# EAGLE design ResponseBoxV1B3 (EAGLE 7.3.0)
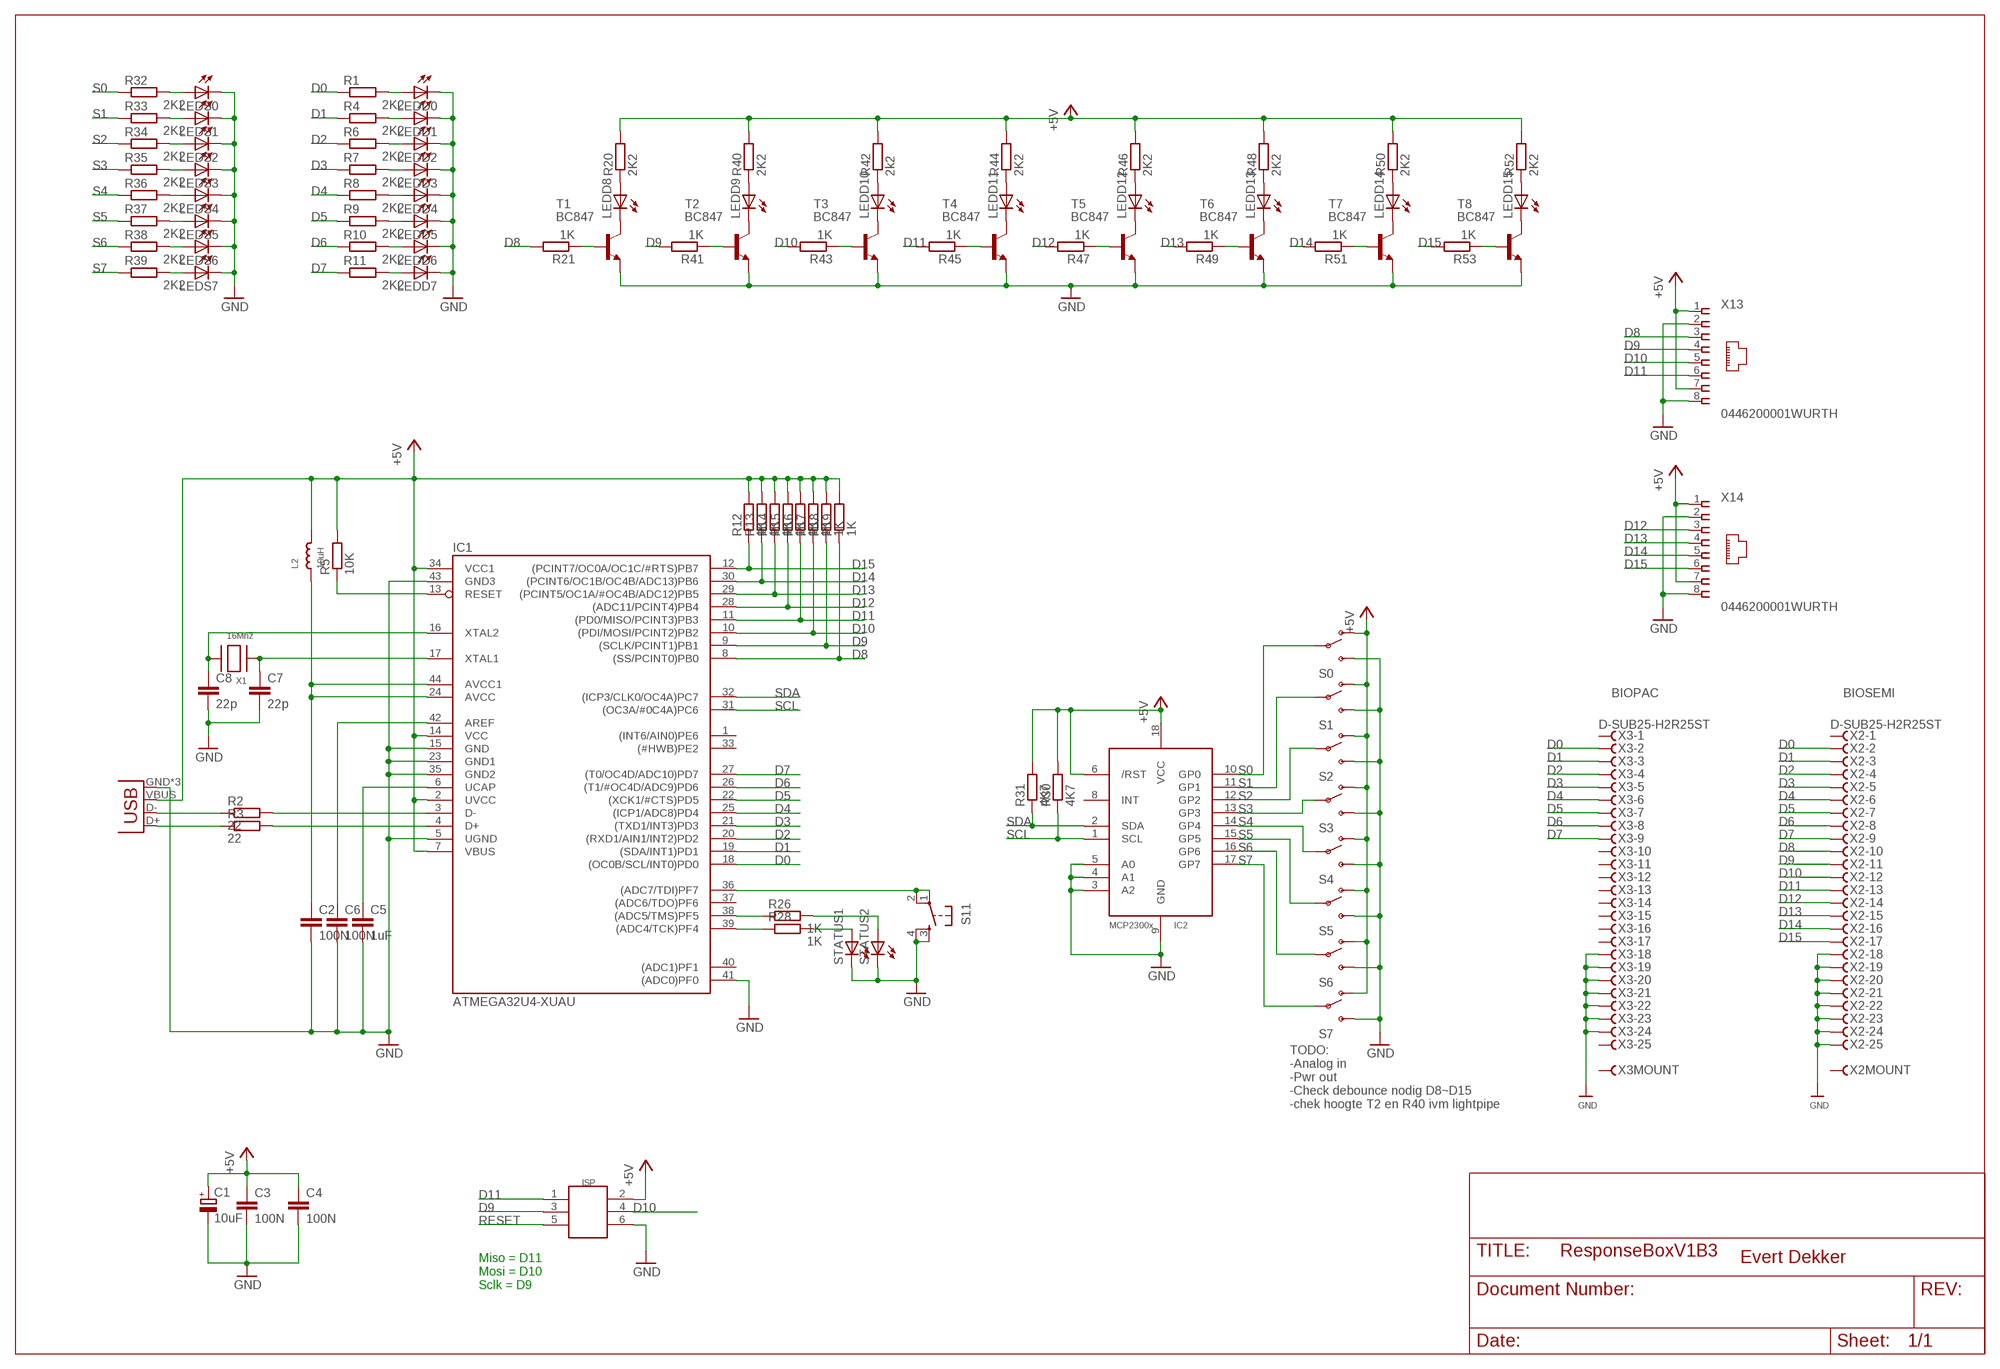
[diagram p0: schematic, sheet 1]

## Parts
C1  10uF  CPOL-EUR/2012-12R  [R/2012-12R]
C2  100N  C-EUC0805  [C0805]
C3  100N  C-EUC0805  [C0805]
C4  100N  C-EUC0805  [C0805]
C5  1uF  C-EUC0805  [C0805]
C6  100N  C-EUC0805  [C0805]
C7  22p  C-EUC0805  [C0805]
C8  22p  C-EUC0805  [C0805]
IC1  ATMEGA32U4-XUAU  [TQFP44-PAD]
IC2  MCP2300X/SO  [SO18W]
ISP  HEADER-2X3P-SMD  [2X3P-2.54-SMD]
L2  10uH  INDUCTOR0805  [0805]
LEDD0  LEDCHIPLED_0805  [CHIPLED_0805]
LEDD1  LEDCHIPLED_0805  [CHIPLED_0805]
LEDD2  LEDCHIP-LED0805  [CHIP-LED0805]
LEDD3  LEDCHIP-LED0805  [CHIP-LED0805]
LEDD4  LEDCHIP-LED0805  [CHIP-LED0805]
LEDD5  LEDCHIP-LED0805  [CHIP-LED0805]
LEDD6  LEDCHIP-LED0805  [CHIP-LED0805]
LEDD7  LEDCHIP-LED0805  [CHIP-LED0805]
LEDD8  LEDCHIPLED_0805  [CHIPLED_0805]
LEDD9  LEDCHIPLED_0805  [CHIPLED_0805]
LEDD10  LEDCHIPLED_0805  [CHIPLED_0805]
LEDD11  LEDCHIPLED_0805  [CHIPLED_0805]
LEDD12  LEDCHIPLED_0805  [CHIPLED_0805]
LEDD13  LEDCHIPLED_0805  [CHIPLED_0805]
LEDD14  LEDCHIPLED_0805  [CHIPLED_0805]
LEDD15  LEDCHIPLED_0805  [CHIPLED_0805]
LEDS0  LEDCHIPLED_0805  [CHIPLED_0805]
LEDS1  LEDCHIPLED_0805  [CHIPLED_0805]
LEDS2  LEDCHIP-LED0805  [CHIP-LED0805]
LEDS3  LEDCHIP-LED0805  [CHIP-LED0805]
LEDS4  LEDCHIP-LED0805  [CHIP-LED0805]
LEDS5  LEDCHIP-LED0805  [CHIP-LED0805]
LEDS6  LEDCHIP-LED0805  [CHIP-LED0805]
LEDS7  LEDCHIP-LED0805  [CHIP-LED0805]
R1  2K2  R-EU_R0805  [R0805]
R2  22  R-EU_R0805  [R0805]
R3  22  R-EU_R0805  [R0805]
R4  2K2  R-EU_R0805  [R0805]
R5  10K  R-EU_R0805  [R0805]
R6  2K2  R-EU_R0805  [R0805]
R7  2K2  R-EU_R0805  [R0805]
R8  2K2  R-EU_R0805  [R0805]
R9  2K2  R-EU_R0805  [R0805]
R10  2K2  R-EU_R0805  [R0805]
R11  2K2  R-EU_R0805  [R0805]
R12  1K  R-EU_R0805  [R0805]
R13  1K  R-EU_R0805  [R0805]
R14  1K  R-EU_R0805  [R0805]
R15  1K  R-EU_R0805  [R0805]
R16  1K  R-EU_R0805  [R0805]
R17  1K  R-EU_R0805  [R0805]
R18  1K  R-EU_R0805  [R0805]
R19  1K  R-EU_R0805  [R0805]
R20  2K2  R-EU_R0805  [R0805]
R21  1K  R-EU_R0805  [R0805]
R26  1K  R-EU_R0805  [R0805]
R28  1K  R-EU_R0805  [R0805]
R30  4K7  R-EU_R0805  [R0805]
R31  4K7  R-EU_R0805  [R0805]
R32  2K2  R-EU_R0805  [R0805]
R33  2K2  R-EU_R0805  [R0805]
R34  2K2  R-EU_R0805  [R0805]
R35  2K2  R-EU_R0805  [R0805]
R36  2K2  R-EU_R0805  [R0805]
R37  2K2  R-EU_R0805  [R0805]
R38  2K2  R-EU_R0805  [R0805]
R39  2K2  R-EU_R0805  [R0805]
R40  2K2  R-EU_R0805  [R0805]
R41  1K  R-EU_R0805  [R0805]
R42  2k2  R-EU_R0805  [R0805]
R43  1K  R-EU_R0805  [R0805]
R44  2K2  R-EU_R0805  [R0805]
R45  1K  R-EU_R0805  [R0805]
R46  2K2  R-EU_R0805  [R0805]
R47  1K  R-EU_R0805  [R0805]
R48  2K2  R-EU_R0805  [R0805]
R49  1K  R-EU_R0805  [R0805]
R50  2K2  R-EU_R0805  [R0805]
R51  1K  R-EU_R0805  [R0805]
R52  2K2  R-EU_R0805  [R0805]
R53  1K  R-EU_R0805  [R0805]
S0  SWITCH-SPST  [SPDT-2MS]
S1  SWITCH-SPST  [SPDT-2MS]
S2  SWITCH-SPST  [SPDT-2MS]
S3  SWITCH-SPST  [SPDT-2MS]
S4  SWITCH-SPST  [SPDT-2MS]
S5  SWITCH-SPST  [SPDT-2MS]
S6  SWITCH-SPST  [SPDT-2MS]
S7  SWITCH-SPST  [SPDT-2MS]
S11  10-XX3ESMD  [3ESMD]
STATUS1  LEDCHIP-LED0805  [CHIP-LED0805]
STATUS2  LEDCHIP-LED0805  [CHIP-LED0805]
T1  BC847  [SOT23]
T2  BC847  [SOT23]
T3  BC847  [SOT23]
T4  BC847  [SOT23]
T5  BC847  [SOT23]
T6  BC847  [SOT23]
T7  BC847  [SOT23]
T8  BC847  [SOT23]
X1  16Mhz  XTALNX5032  [NX5032]
X2  D-SUB25-H2R25ST  [H2R25ST]
X3  D-SUB25-H2R25ST  [H2R25ST]
X12  USBPTH-VERTICAL  [USB-B-PTH-VERTICAL]
X13  0446200001WURTH  [WURTH-WR-MJ]
X14  0446200001WURTH  [WURTH-WR-MJ]

## Nets
+5V [Vcc]: C1.+ C3.2 C4.2 IC1.2(UVCC) IC1.7(VBUS) IC1.14(VCC) IC1.34(VCC1) IC2.6(/RST) IC2.18(VCC) ISP.2 L2.2 R5.2 R12.2 R13.2 R14.2 R15.2 R16.2 R17.2 R18.2 R19.2 R20.2 R30.2 R31.2 R40.2 R42.2 R44.2 R46.2 R48.2 R50.2 R52.2 S0.1(O) S1.1(O) S2.1(O) S3.1(O) S4.1(O) S5.1(O) S6.1(O) S7.1(O) X12.VBUS X13.1 X13.7 X14.1 X14.7
D0: IC1.18((OC0B/SCL/INT0)PD0) R1.1 X2.2 X3.2
D1: IC1.19((SDA/INT1)PD1) R4.1 X2.3 X3.3
D2: IC1.20((RXD1/AIN1/INT2)PD2) R6.1 X2.4 X3.4
D3: IC1.21((TXD1/INT3)PD3) R7.1 X2.5 X3.5
D4: IC1.25((ICP1/ADC8)PD4) R8.1 X2.6 X3.6
D5: IC1.22((XCK1/#CTS)PD5) R9.1 X2.7 X3.7
D6: IC1.26((T1/#OC4D/ADC9)PD6) R10.1 X2.8 X3.8
D7: IC1.27((T0/OC4D/ADC10)PD7) R11.1 X2.9 X3.9
D8: IC1.8((SS/PCINT0)PB0) R19.1 R21.2 X2.10 X13.3
D9: IC1.9((SCLK/PCINT1)PB1) ISP.3 R18.1 R41.2 X2.11 X13.4
D10: IC1.10((PDI/MOSI/PCINT2)PB2) ISP.4 R17.1 R43.2 X2.12 X13.5
D11: IC1.11((PD0/MISO/PCINT3)PB3) ISP.1 R16.1 R45.2 X2.13 X13.6
D12: IC1.28((ADC11/PCINT4)PB4) R15.1 R47.2 X2.14 X14.3
D13: IC1.29((PCINT5/OC1A/#OC4B/ADC12)PB5) R14.1 R49.2 X2.15 X14.4
D14: IC1.30((PCINT6/OC1B/OC4B/ADC13)PB6) R13.1 R51.2 X2.16 X14.5
D15: IC1.12((PCINT7/OC0A/OC1C/#RTS)PB7) R12.1 R53.2 X2.17 X14.6
D+: IC1.4(D+) R3.2
D-: IC1.3(D-) R2.2
GND: C1.- C2.2 C3.1 C4.1 C5.2 C6.2 C7.2 C8.2 IC1.5(UGND) IC1.15(GND) IC1.23(GND1) IC1.35(GND2) IC1.41((ADC0)PF0) IC1.43(GND3) IC2.3(A2) IC2.4(A1) IC2.5(A0) IC2.9(GND) ISP.6 LEDD0.C LEDD1.C LEDD2.C LEDD3.C LEDD4.C LEDD5.C LEDD6.C LEDD7.C LEDS0.C LEDS1.C LEDS2.C LEDS3.C LEDS4.C LEDS5.C LEDS6.C LEDS7.C S0.3(S) S1.3(S) S2.3(S) S3.3(S) S4.3(S) S5.3(S) S6.3(S) S7.3(S) S11.3(S) S11.4(S1) STATUS1.C STATUS2.C T1.2(E) T2.2(E) T3.2(E) T4.2(E) T5.2(E) T6.2(E) T7.2(E) T8.2(E) X2.18 X2.19 X2.20 X2.21 X2.22 X2.23 X2.24 X2.25 X3.18 X3.19 X3.20 X3.21 X3.22 X3.23 X3.24 X12.GND X12.MP1(GND) X12.MP2(GND) X13.2 X13.8 X14.2 X14.8
N$1: R2.1 X12.D-
N$2: R3.1 X12.D+
N$3: LEDD8.A R20.1
N$4: LEDD8.C T1.3(C)
N$5: R21.1 T1.1(B)
N$6: C2.1 IC1.24(AVCC) IC1.44(AVCC1) L2.1
N$7: LEDD0.A R1.2
N$8: LEDD1.A R4.2
N$13: IC1.38((ADC5/TMS)PF5) R26.1
N$14: IC1.39((ADC4/TCK)PF4) R28.1
N$15: R26.2 STATUS2.A
N$16: R28.2 STATUS1.A
N$20: LEDD2.A R6.2
N$26: LEDD3.A R7.2
N$27: LEDD4.A R8.2
N$28: LEDD5.A R9.2
N$29: LEDD6.A R10.2
N$30: LEDD7.A R11.2
N$31: LEDS0.A R32.2
N$32: LEDS1.A R33.2
N$33: LEDS2.A R34.2
N$34: LEDS3.A R35.2
N$35: LEDS4.A R36.2
N$36: LEDS5.A R37.2
N$37: LEDS6.A R38.2
N$38: LEDS7.A R39.2
N$39: IC1.36((ADC7/TDI)PF7) S11.1(P) S11.2(P1)
N$40: LEDD9.A R40.1
N$41: LEDD9.C T2.3(C)
N$42: R41.1 T2.1(B)
N$43: LEDD10.A R42.1
N$45: LEDD10.C T3.3(C)
N$47: R43.1 T3.1(B)
N$48: C6.1 IC1.42(AREF)
N$50: C5.1 IC1.6(UCAP)
N$52: LEDD11.A R44.1
N$53: LEDD11.C T4.3(C)
N$54: R45.1 T4.1(B)
N$55: LEDD12.A R46.1
N$56: LEDD12.C T5.3(C)
N$57: R47.1 T5.1(B)
N$58: LEDD13.A R48.1
N$59: LEDD13.C T6.3(C)
N$60: R49.1 T6.1(B)
N$61: LEDD14.A R50.1
N$62: LEDD14.C T7.3(C)
N$63: R51.1 T7.1(B)
N$64: LEDD15.A R52.1
N$65: LEDD15.C T8.3(C)
N$66: R53.1 T8.1(B)
RESET: IC1.13(RESET) ISP.5 R5.1
S0: IC2.10(GP0) R32.1 S0.2(P)
S1: IC2.11(GP1) R33.1 S1.2(P)
S2: IC2.12(GP2) R34.1 S2.2(P)
S3: IC2.13(GP3) R35.1 S3.2(P)
S4: IC2.14(GP4) R36.1 S4.2(P)
S5: IC2.15(GP5) R37.1 S5.2(P)
S6: IC2.16(GP6) R38.1 S6.2(P)
S7: IC2.17(GP7) R39.1 S7.2(P)
SCL: IC1.31((OC3A/#0C4A)PC6) IC2.1(SCL) R30.1
SDA: IC1.32((ICP3/CLK0/OC4A)PC7) IC2.2(SDA) R31.1
XTAL1: C7.1 IC1.17(XTAL1) X1.P$1
XTAL2: C8.1 IC1.16(XTAL2) X1.P$2
Unconnected: IC1.1((INT6/AIN0)PE6) IC1.33((#HWB)PE2) IC1.37((ADC6/TDO)PF6) IC1.40((ADC1)PF1) IC2.8(INT) X2.1 X2.M1 X2.M2 X3.1 X3.10 X3.11 X3.12 X3.13 X3.14 X3.15 X3.16 X3.17 X3.25 X3.M1 X3.M2

## Notes on the sheet
- BIOPAC | BIOSEMI
- TODO:
  -Analog in
  -Pwr out
  -Check debounce nodig D8~D15
  -chek hoogte T2 en R40 ivm lightpipe
- Evert Dekker
- Miso = D11
  Mosi = D10
  Sclk = D9

## Library data of the parts
C1 = rcl:CPOL-EU: POLARIZED CAPACITOR, European symbol; FARNELL: 1867958
C2 C3 = rcl:C-EU: CAPACITOR, European symbol; FARNELL: 1833888
C4 C6 = rcl:C-EU: CAPACITOR, European symbol
C5 = rcl:C-EU: CAPACITOR, European symbol; FARNELL: 1327700
C7 C8 = rcl:C-EU: CAPACITOR, European symbol; FARNELL: 1759489
IC1 = SmartPrj:ATMEGA32U4-XU; FARNELL: 1748525; RS: 715-3805
IC2 = adafruit:MCP2300X: MCP23008 Inexpensive i2c i/o expander - 8 general purpose i/o pins with optional pullups; FARNELL: 1332086
ISP = HR911105:HEADER-2X3P; FARNELL: 9689567
L2 = microbuilder:INDUCTOR: Inductors 0603: 10nH Ceramic Inductor - microwire antenna/RF (Digikey: 712-1434-2-ND) 0805: 560nH Ceramic Inductor - RF (Digikey: 553-1047-1-ND) 270nH Ceramic Inductor - Q = 40@250MHz, +-5%, 1 Ohm DC Resistance (Digikey: 535-10506-2-ND) 1007 (2518 Metric) SMT: 10µH 10% 250mOhm 820mA 1007 Inductor (Digikey: 587-2189-1-ND) 22µH 10% 500mOhm 580mA 1007 Inductor (Digikey: 587-2190-1-ND) 47µH 10% 950mOhm 420mA 1007 Inductor (Digikey: 587-2191-1-ND) 47µH 5% 100mOhm 1A 1008 Inductor (Digikey: 732-1816-1-ND) 5.0x5.0mm (Taiyo Yuden NR5040 Series) 6.8µH 20% 2.3A 64mOhm Inductor (Digikey: 587-2374-2-ND) 5.0x5.0mm (TDK VLC5045 Series) 4.7µH 20% 3.3A 34mOhm Inductor (Digikey: 445-6526-1-ND) 6.8µH 20% 2.7A 46mOhm Inductor (Digikey: 445-6527-1-ND) 6.0x6.0mm (TDK VLC6045 Series) 4.7µH 20% 3.8A 27mOhm Inductor (Digikey: 445-6538-2-ND) 6.8µH 20% 3A 41mOhm Inductor (Digikey: 445-6540-1-ND) 6.2µH 30% 2.2A 45mOhm Inductor (Digikey: SRR5028-6R2YCT-ND) - Not TDK VLC6045 but footprint should match 6.0x6.0mm (TDK SLF6045 Series) 6.8uH 30% 2A 33mOhm Inductor (Digikey: 445-4572-1-ND, Mouser: 810-SLF645T6R8N2R0PF); FARNELL: 2215650
LEDD0 LEDD1-LEDD6 LEDD8-LEDD15 LEDS1-LEDS7 STATUS1 STATUS2 = led:LED: LED OSRAM: - CHIPLED LG R971, LG N971, LY N971, LG Q971, LY Q971, LO R971, LY R971 LH N974, LH R974 LS Q976, LO Q976, LY Q976 LO Q996 - Hyper CHIPLED LW Q18S LB Q993, LB Q99A, LB R99A - SideLED LS A670, LO A670, LY A670, LG A670, LP A670 LB A673, LV A673, LT A673, LW A673 LH A674 LY A675 LS A676, LA A676, LO A676, LY A676, LW A676 LS A679, LY A679, LG A679 - Hyper Micro SIDELED® LS Y876, LA Y876, LO Y876, LY Y876 LT Y87S - SmartLED LW L88C, LW L88S LB L89C, LB L89S, LG L890 LS L89K, LO L89K, LY L89K LS L896, LA L896, LO L896, LY L896 - TOPLED LS T670, LO T670, LY T670, LG T670, LP T670 LSG T670, LSP T670, LSY T670, LOP T670, LYG T670 LG T671, LOG T671, LSG T671 LB T673, LV T673, LT T673, LW T673 LH T674 LS T676, LA T676, LO T676, LY T676, LB T676, LH T676, LSB T676, LW T676 LB T67C, LV T67C, LT T67C, LS T67K, LO T67K, LY T67K, LW E67C LS E67B, LA E67B, LO E67B, LY E67B, LB E67C, LV E67C, LT E67C LW T67C LS T679, LY T679, LG T679 LS T770, LO T770, LY T770, LG T770, LP T770 LB T773, LV T773, LT T773, LW T773 LH T774 LS E675, LA E675, LY E675, LS T675 LS T776, LA T776, LO T776, LY T776, LB T776 LHGB T686 LT T68C, LB T68C - Hyper Mini TOPLED® LB M676 - Mini TOPLED Santana® LG M470 LS M47K, LO M47K, LY M47K Source: http://www.osram.convergy.de LUXEON: - LUMILED® LXK2-PW12-R00, LXK2-PW12-S00, LXK2-PW14-U00, LXK2-PW14-V00 LXK2-PM12-R00, LXK2-PM12-S00, LXK2-PM14-U00 LXK2-PE12-Q00, LXK2-PE12-R00, LXK2-PE12-S00, LXK2-PE14-T00, LXK2-PE14-U00 LXK2-PB12-K00, LXK2-PB12-L00, LXK2-PB12-M00, LXK2-PB14-N00, LXK2-PB14-P00, LXK2-PB14-Q00 LXK2-PR12-L00, LXK2-PR12-M00, LXK2-PR14-Q00, LXK2-PR14-R00 LXK2-PD12-Q00, LXK2-PD12-R00, LXK2-PD12-S00 LXK2-PH12-R00, LXK2-PH12-S00 LXK2-PL12-P00, LXK2-PL12-Q00, LXK2-PL12-R00 Source: www.luxeon.com KINGBRIGHT: KA-3528ASYC Source: www.kingbright.com
LEDD7 LEDS0 = led:LED: LED OSRAM: - CHIPLED LG R971, LG N971, LY N971, LG Q971, LY Q971, LO R971, LY R971 LH N974, LH R974 LS Q976, LO Q976, LY Q976 LO Q996 - Hyper CHIPLED LW Q18S LB Q993, LB Q99A, LB R99A - SideLED LS A670, LO A670, LY A670, LG A670, LP A670 LB A673, LV A673, LT A673, LW A673 LH A674 LY A675 LS A676, LA A676, LO A676, LY A676, LW A676 LS A679, LY A679, LG A679 - Hyper Micro SIDELED® LS Y876, LA Y876, LO Y876, LY Y876 LT Y87S - SmartLED LW L88C, LW L88S LB L89C, LB L89S, LG L890 LS L89K, LO L89K, LY L89K LS L896, LA L896, LO L896, LY L896 - TOPLED LS T670, LO T670, LY T670, LG T670, LP T670 LSG T670, LSP T670, LSY T670, LOP T670, LYG T670 LG T671, LOG T671, LSG T671 LB T673, LV T673, LT T673, LW T673 LH T674 LS T676, LA T676, LO T676, LY T676, LB T676, LH T676, LSB T676, LW T676 LB T67C, LV T67C, LT T67C, LS T67K, LO T67K, LY T67K, LW E67C LS E67B, LA E67B, LO E67B, LY E67B, LB E67C, LV E67C, LT E67C LW T67C LS T679, LY T679, LG T679 LS T770, LO T770, LY T770, LG T770, LP T770 LB T773, LV T773, LT T773, LW T773 LH T774 LS E675, LA E675, LY E675, LS T675 LS T776, LA T776, LO T776, LY T776, LB T776 LHGB T686 LT T68C, LB T68C - Hyper Mini TOPLED® LB M676 - Mini TOPLED Santana® LG M470 LS M47K, LO M47K, LY M47K Source: http://www.osram.convergy.de LUXEON: - LUMILED® LXK2-PW12-R00, LXK2-PW12-S00, LXK2-PW14-U00, LXK2-PW14-V00 LXK2-PM12-R00, LXK2-PM12-S00, LXK2-PM14-U00 LXK2-PE12-Q00, LXK2-PE12-R00, LXK2-PE12-S00, LXK2-PE14-T00, LXK2-PE14-U00 LXK2-PB12-K00, LXK2-PB12-L00, LXK2-PB12-M00, LXK2-PB14-N00, LXK2-PB14-P00, LXK2-PB14-Q00 LXK2-PR12-L00, LXK2-PR12-M00, LXK2-PR14-Q00, LXK2-PR14-R00 LXK2-PD12-Q00, LXK2-PD12-R00, LXK2-PD12-S00 LXK2-PH12-R00, LXK2-PH12-S00 LXK2-PL12-P00, LXK2-PL12-Q00, LXK2-PL12-R00 Source: www.luxeon.com KINGBRIGHT: KA-3528ASYC Source: www.kingbright.com; FARNELL: 2062573
R1 R32 = rcl:R-EU_: RESISTOR, European symbol; FARNELL: 2447686
R2 = rcl:R-EU_: RESISTOR, European symbol; FARNELL: 2447609
R3 R4 R6-R11 R13-R21 R26 R28 R31 R33-R53 = rcl:R-EU_: RESISTOR, European symbol
R5 = rcl:R-EU_: RESISTOR, European symbol; FARNELL: 2447553
R12 = rcl:R-EU_: RESISTOR, European symbol; FARNELL: 2074332
R30 = rcl:R-EU_: RESISTOR, European symbol; FARNELL: 2694141
S0 = MulticompSwitch:SWITCH-SPST: SPST Switch Simple slide switch. Spark Fun Electronics SKU : COM-00102; FARNELL: 9472967
S1-S7 = MulticompSwitch:SWITCH-SPST: SPST Switch Simple slide switch. Spark Fun Electronics SKU : COM-00102
S11 = switch-omron:10-XX: OMRON SWITCH; RS-COMPONENTS: 495-2264
T1 = transistor-neu-to92:BC847: NPN TRANSISTOR; FARNELL: 1081230
T2-T8 = transistor-neu-to92:BC847: NPN TRANSISTOR
X1 = adafruit:XTAL: Low cost SMT crystals, no capacitors included http://www.ladyada.net/library/eagle; FARNELL: 2467791
X2 X3 = SubD25:D-SUB25-: D-Subminiatur Connector Source: Electronioc Interconnects European Edition 1998; FARNELL: 2752229; MF: TYCO ELECTRONICS; MPN: H2R25ST29J; OC_FARNELL: unknown; OC_NEWARK: 16F4224
X12 = SparkFun:USB: USB Connectors USB-B-PTH is fully proven SKU : PRT-00139 USB-miniB is fully proven SKU : PRT-00587 USB-A-PCB is untested. USB-A-H is throughly reviewed, but untested. Spark Fun Electronics SKU : PRT-00437 USB-B-SMT is throughly reviewed, but untested. Needs silkscreen touching up. USB-A-S has not been used/tested USB-MB-H has not been used/tested; FARNELL: 1696538
X13 X14 = Rj45Wurth:0446200001: RJ-45 INVERTED MODULAR JACK ASSEMBLY WITH RJ-11 KEEPOUT FEATURE Source: Data sheet <http://www.farnell.com/datasheets/73207.pdf>; FARNELL: 1841170

## Net classes
0 default: width 0.305 mm, clearance 0.203 mm
1 RowCols: width 0.356 mm, clearance 0.203 mm
2 Vcc: width 0.356 mm, clearance 0.203 mm

## Board
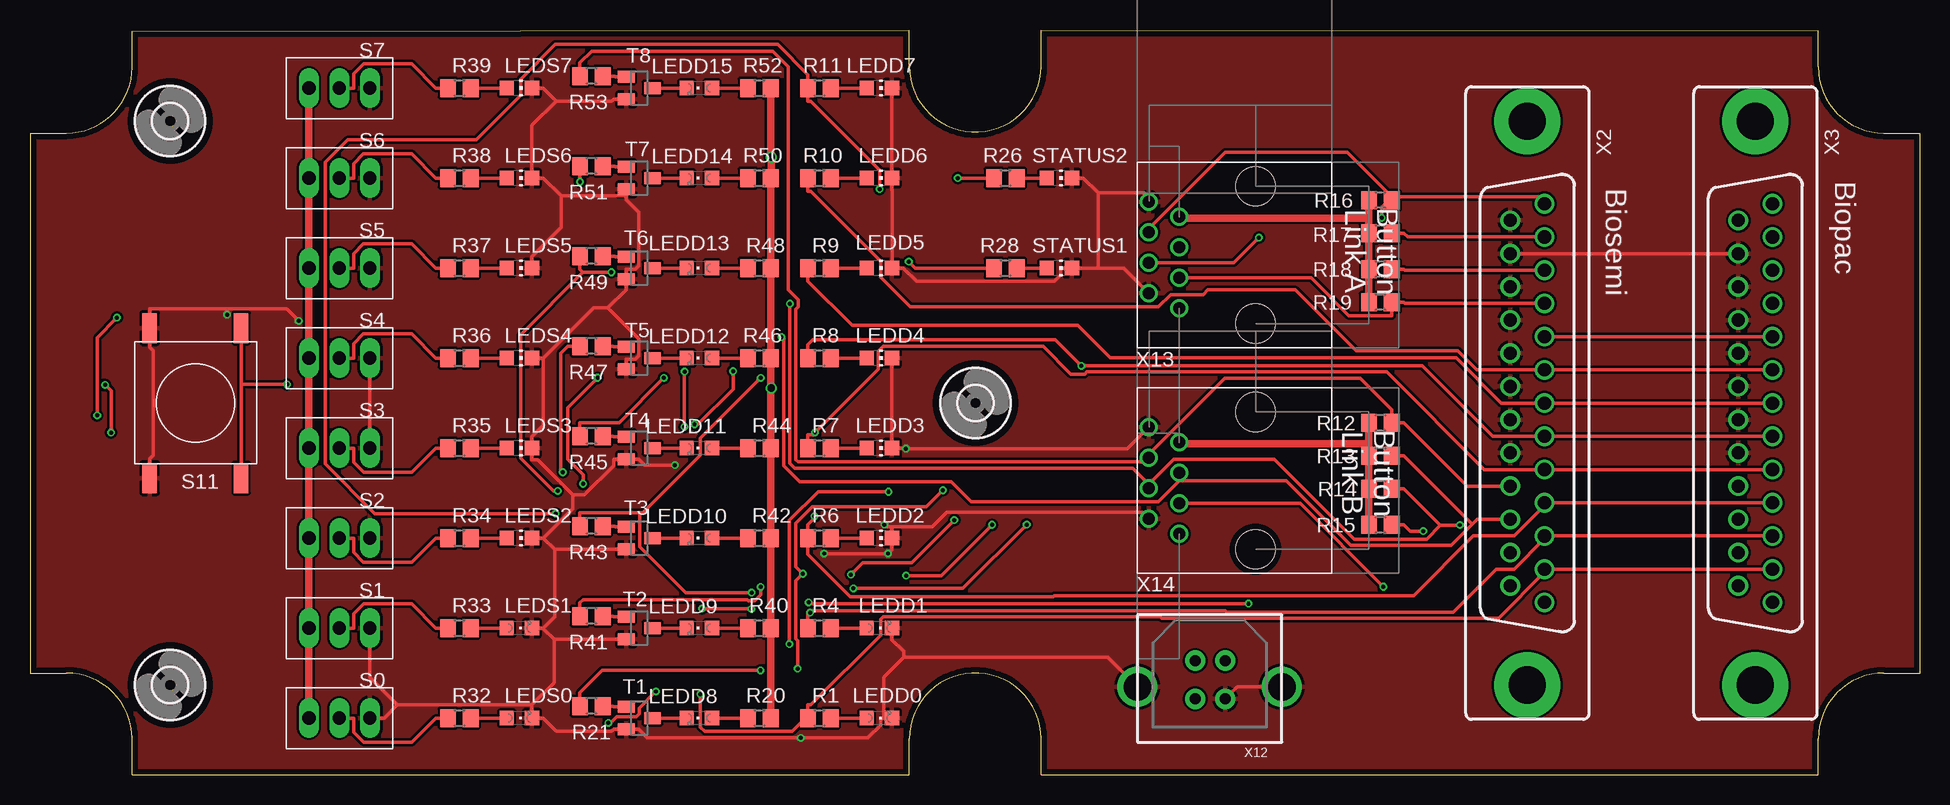
[diagram p1: board, top side]
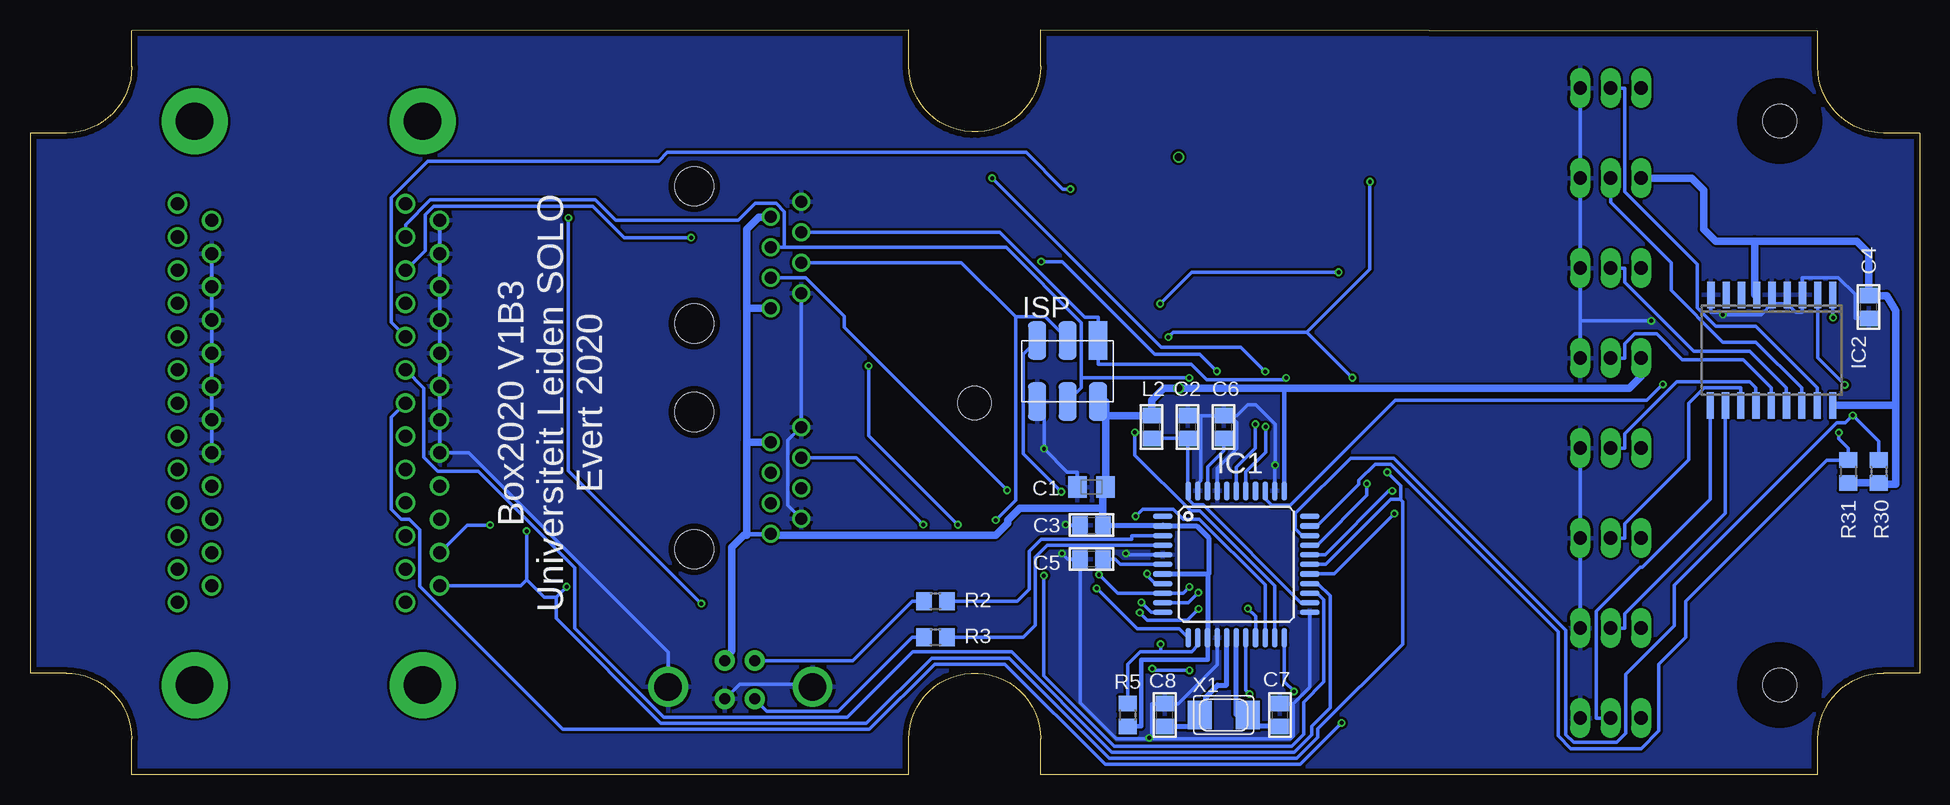
[diagram p2: board, bottom side, seen from below]

Size 157.5 x 62.08 mm. Coordinates in mm from the lower left corner, seen from the top.
Outline: 73.27,59.08 arc180 84.27,59.06 84.27,62.06 149.02,62 149.02,59 arc90 154.49,53.5 157.49,53.5 157.5,8.5 154.5,8.5 arc90 149.02,3 149.02,0 84.27,0 84.27,3 arc180 73.27,3 73.27,0 8.52,0.02 8.52,3.02 arc90 3.03,8.5 0.03,8.5 0,53.5 3,53.5 arc90 8.52,58.99 8.52,61.99 73.27,62.08 73.27,59.08
Copper layers (1*16): Top 0.035mm / dielectric 1.6mm / Bottom 0.035mm
Design rules "Elecrow_2-layer_PCB_eagle_rule *": minimum track width 6mil, minimum drill 13mil, track to track 8mil, track to pad 8mil, pad to pad 8mil, via to via 8mil, smd to smd 0mil, copper to edge 20mil, drill to drill 10mil, minimum pad ring 6mil, minimum via ring 6mil, stop-mask expansion 0mil, vias tented up to drill 100mil, thermal gap 10mil

### Footprints (pad centres in the part's own frame; a part is rotated, then mirrored left to right if it is on the bottom)
R/2012-12R = smd 1.55 x 1.8: + 1.175,0; - -1.175,0
C0805 = smd 1.3 x 1.5: 1 -0.95,0; 2 0.95,0
TQFP44-PAD = smd 1.6 x 0.45: 1 -6.117,4; 2 -6.117,3.2; 3 -6.117,2.4; 4 -6.117,1.6; 5 -6.117,0.8; 6 -6.117,0; 7 -6.117,-0.8; 8 -6.117,-1.6; 9 -6.117,-2.4; 10 -6.117,-3.2; 11 -6.117,-4; 23 6.117,-4; 24 6.117,-3.2; 25 6.117,-2.4; 26 6.117,-1.6; 27 6.117,-0.8; 28 6.117,0; 29 6.117,0.8; 30 6.117,1.6; 31 6.117,2.4; 32 6.117,3.2; 33 6.117,4 | smd 0.45 x 1.6: 12 -4,-6.117; 13 -3.2,-6.117; 14 -2.4,-6.117; 15 -1.6,-6.117; 16 -0.8,-6.117; 17 0,-6.117; 18 0.8,-6.117; 19 1.6,-6.117; 20 2.4,-6.117; 21 3.2,-6.117; 22 4,-6.117; 34 4,6.117; 35 3.2,6.117; 36 2.4,6.117; 37 1.6,6.117; 38 0.8,6.117; 39 0,6.117; 40 -0.8,6.117; 41 -1.6,6.117; 42 -2.4,6.117; 43 -3.2,6.117; 44 -4,6.117
SO18W = smd 0.6 x 2.2: 1 -4.445,-4.6; 2 -3.175,-4.6; 3 -1.905,-4.6; 4 -0.635,-4.6; 5 0.635,-4.6; 6 1.905,-4.6; 7 3.175,-4.6; 8 4.445,-4.6; 9 5.715,-4.6; 10 5.775,4.6; 11 4.505,4.6; 12 3.235,4.6; 13 1.965,4.6; 14 0.695,4.6; 15 -0.575,4.6; 16 -1.845,4.6; 17 -3.145,4.6; 18 -4.445,4.6
2X3P-2.54-SMD = smd 3.2 x 1.524: 1 -2.54,2.54; 2 2.54,2.54; 3 -2.54,0; 4 2.54,0; 5 -2.54,-2.54; 6 2.54,-2.54
0805 = smd 1.3 x 1.5: 1 -0.95,0; 2 0.95,0
CHIPLED_0805 = smd 1.2 x 1.2: A 0,-1.05; C 0,1.05
CHIP-LED0805 = smd 1.2 x 1.2: A 0,-1.05; C 0,1.05
R0805 = smd 1.3 x 1.5: 1 -0.95,0; 2 0.95,0
SPDT-2MS = drill 1.1 long: 1 0,-2.54; 2 0,0; 3 0,2.54
3ESMD = smd 2.5 x 1.2: 1 6.25,3.81; 2 -6.25,3.81; 3 6.25,-3.81; 4 -6.25,-3.81
SOT23 = smd 1 x 1.4: 1 -0.95,-1.1; 2 0.95,-1.1; 3 0,1.1
MOUNTINGHOLE_2.8 = hole 2.8: 0,0
NX5032 = smd 2 x 2.4: P$1 2,0; P$2 -2,0
H2R25ST = drill 1.092: 1 16.612,1.422; 2 13.843,1.422; 3 11.074,1.422; 4 8.306,1.422; 5 5.537,1.422; 6 2.769,1.422; 7 0,1.422; 8 -2.769,1.422; 9 -5.537,1.422; 10 -8.306,1.422; 11 -11.074,1.422; 12 -13.843,1.422; 13 -16.612,1.422; 14 15.227,-1.422; 15 12.459,-1.422; 16 9.69,-1.422; 17 6.921,-1.422; 18 4.153,-1.422; 19 1.384,-1.422; 20 -1.384,-1.422; 21 -4.153,-1.422; 22 -6.921,-1.422; 23 -9.69,-1.422; 24 -12.459,-1.422; 25 -15.227,-1.422 | drill 3.1 pad 5.5: M1 -23.495,0; M2 23.495,0
USB-B-PTH-VERTICAL = drill 0.92 pad 1.676: D+ 4.826,3.594; D- 4.826,6.795; GND 7.315,3.594; VBUS 7.315,6.795 | drill 2.3: MP1 0,4.602; MP2 12.04,4.602
WURTH-WR-MJ = drill 1: 1 0,0; 2 1.27,2.54; 3 2.54,0; 4 3.81,2.54; 5 5.08,0; 6 6.35,2.54; 7 7.62,0; 8 8.89,2.54 | hole 3.25: -1.27,-6.35; 10.16,-6.35

### Placement (x,y rotation side)
C1  69.03,23.99 0 bottom
C2  61.03,28.99 90 bottom
C3  69.04,20.82 0 bottom
C4  4.28,38.99 90 bottom
C5  69.03,17.99 180 bottom
C6  58.03,28.99 90 bottom
C7  53.33,4.99 90 bottom
C8  62.93,4.99 90 bottom
IC1  56.97,17.55 0 bottom
IC2  11.7,35.4 180 bottom
ISP  71.03,33.66 270 bottom
L2  64.03,28.99 90 bottom
LEDD0  70.78,4.74 270 top
LEDD1  70.78,12.24 270 top
LEDD2  70.78,19.74 270 top
LEDD3  70.78,27.24 270 top
LEDD4  70.78,34.74 270 top
LEDD5  70.78,42.24 270 top
LEDD6  70.78,49.74 270 top
LEDD7  70.78,57.24 270 top
LEDD8  55.78,4.74 90 top
LEDD9  55.78,12.24 90 top
LEDD10  55.78,19.74 90 top
LEDD11  55.78,27.24 90 top
LEDD12  55.78,34.74 90 top
LEDD13  55.78,42.24 90 top
LEDD14  55.78,49.74 90 top
LEDD15  55.78,57.24 90 top
LEDS0  40.78,4.74 270 top
LEDS1  40.78,12.24 270 top
LEDS2  40.78,19.74 270 top
LEDS3  40.78,27.24 270 top
LEDS4  40.78,34.74 270 top
LEDS5  40.78,42.24 270 top
LEDS6  40.78,49.74 270 top
LEDS7  40.78,57.24 270 top
R1  65.78,4.74 0 top
R2  82.03,14.49 0 bottom
R3  82.03,11.49 0 bottom
R4  65.78,12.24 0 top
R5  66.03,4.99 270 bottom
R6  65.78,19.74 0 top
R7  65.78,27.24 0 top
R8  65.78,34.74 0 top
R9  65.78,42.24 0 top
R10  65.78,49.74 0 top
R11  65.78,57.24 0 top
R12  112.53,29.34 180 top
R13  112.53,26.59 180 top
R14  112.53,23.84 180 top
R15  112.53,20.84 180 top
R16  112.53,47.89 180 top
R17  112.53,45.14 180 top
R18  112.53,42.14 180 top
R19  112.53,39.39 180 top
R20  60.78,4.74 0 top
R21  46.78,5.74 180 top
R26  81.28,49.74 0 top
R28  81.28,42.24 0 top
R30  3.43,25.29 270 bottom
R31  5.98,25.29 270 bottom
R32  35.78,4.74 0 top
R33  35.78,12.24 0 top
R34  35.78,19.74 0 top
R35  35.78,27.24 0 top
R36  35.78,34.74 0 top
R37  35.78,42.24 0 top
R38  35.78,49.74 0 top
R39  35.78,57.24 0 top
R40  60.78,12.24 0 top
R41  46.78,13.24 180 top
R42  60.78,19.74 0 top
R43  46.78,20.74 180 top
R44  60.78,27.24 0 top
R45  46.78,28.24 180 top
R46  60.78,34.74 0 top
R47  46.78,35.74 180 top
R48  60.78,42.24 0 top
R49  46.78,43.24 180 top
R50  60.78,49.74 0 top
R51  46.78,50.74 180 top
R52  60.78,57.24 0 top
R53  46.78,58.24 180 top
S0  25.78,4.74 270 top
S1  25.78,12.24 270 top
S2  25.78,19.74 270 top
S3  25.78,27.24 270 top
S4  25.78,34.74 270 top
S5  25.78,42.24 270 top
S6  25.78,49.74 270 top
S7  25.78,57.24 270 top
S11  13.78,30.99 270 top
STATUS1  85.78,42.24 270 top
STATUS2  85.78,49.74 270 top
T1  50.78,4.74 270 top
T2  50.78,12.24 270 top
T3  50.78,19.74 270 top
T4  50.78,27.24 270 top
T5  50.78,34.74 270 top
T6  50.78,42.24 270 top
T7  50.78,49.74 270 top
T8  50.78,57.24 270 top
U$2  [MOUNTINGHOLE_2.8]  11.68,7.49 0 top
U$4  [MOUNTINGHOLE_2.8]  78.78,30.99 0 top
U$6  [MOUNTINGHOLE_2.8]  11.68,54.49 0 top
X1  58.03,4.99 0 bottom
X2  124.78,30.99 270 top
X3  143.78,30.99 270 top
X12  92.28,2.74 0 top
X13  95.78,38.89 90 top
X14  95.78,20.09 90 top

### Tracks (layer width: path | path; a pad name or v marks a point on that pad's centre or on a via)
+5V  (via drill 0.6 pad 0.9)
  Top 0.356: v61.78,32.24 61.73,32.24
  Top 0.61: 111.58,27.59 95.78,27.59 X14.7 | R15.2 R14.2 R13.2 111.58,27.59 | R12.2 111.58,27.59 | 111.58,46.4 95.78,46.4 X13.7 | R19.2 R18.2 R17.2 111.58,46.4 | R16.2 111.58,46.4 | S0.1 S1.1 S2.1 S3.1 S4.1 S5.1 S6.1 S7.1 | 61.53,57.24 R52.2 61.73,51.49 v61.78,51.49 61.78,49.74 R50.2 R48.2 R46.2 61.73,32.24 R44.2 R42.2 R40.2 R20.2
  Bottom 0.356: 95.78,46.49 X13.7 | 95.78,20.04 97.78,20.04 | 95.78,19.99 95.78,20.04 | 95.78,20.04 X14.1 | R5.2 64.9,4.04 64.9,9.58 59.37,9.58 IC1.14 | 52.97,32.24 IC1.34
  Bottom 0.406: C3.2 63.09,20.82 IC1.2 60.28,20.75 59.28,19.75 59.28,16.74 59.37,16.74 | 59.37,16.74 IC1.7 | 59.37,16.74 IC1.14
  Bottom 0.61: X13.1 97.78,38.89 | 97.78,38.89 97.78,27.71 | X14.7 97.78,27.71 | C1.+ 67.86,31.12 ISP.2 68.49,29.94 L2.2 64.03,31.24 63.03,32.24 v61.78,32.24 52.97,32.24 24.24,32.24 23.24,33.24 S4.1 | 67.86,23.49 C1.+ | R31.2 R30.2 3.43,24.24 2.03,24.24 2.03,30.8 | S6.1 19.03,49.74 18.03,48.74 18.03,45.49 17.03,44.49 13.78,44.49 | 13.78,44.49 5.28,44.49 4.28,43.49 C4.2 2.78,39.94 2.03,38.69 2.03,30.8 | IC2.6 13.78,40 13.78,44.49 | IC2.18 2.03,30.8 | C1.+ 68.09,23.99 68.09,22.24 | 68.09,22.24 C3.2 | 95.78,19.99 77.03,19.99 76.03,20.99 76.03,21.24 75.03,22.24 68.09,22.24 | 97.78,38.89 97.78,45.49 96.78,46.49 95.78,46.49 | X12.VBUS 99.03,10.33 99.03,18.99 98.03,19.99 97.78,19.99 97.78,20.04 97.78,27.71
D0  (via drill 0.33 pad 0.64)
  Top 0.305: 64.83,4.95 63.51,3.63 56.23,3.63 55.86,3.99 v55.86,6.74 | 64.83,4.95 64.83,5.84 65.07,5.84 70.88,11.65 70.88,12.99 71.08,13.19 94.19,13.19 94.32,13.06 122.38,13.06 126.2,16.89 X2.2 X3.2 | R1.1 64.83,4.95
  Bottom 0.305: IC1.18 56.17,7.04 v55.86,6.74
D1  (via drill 0.33 pad 0.64)
  Top 0.305: v56.01,13.86 60.09,13.86 v60.11,13.84 | X3.3 X2.3 126.2,19.67 123.68,17.15 122.18,17.15 118.61,13.57 99.73,13.57 99.6,13.7 65.19,13.7 v65.01,13.52 64.83,13.34 R4.1
  Bottom 0.305: v65.01,13.52 64.4,12.91 61.04,12.91 v60.11,13.84 | IC1.19 55.37,13.22 v56.01,13.86
D2  (via drill 0.33 pad 0.64)
  Top 0.305: X3.4 X2.4 126.2,22.44 123.68,19.91 120.27,19.91 115.31,14.95 85.37,14.95 85.29,14.87 68.34,14.87 64.83,18.37 R6.1 64.83,20.84 65.36,21.37 v65.36,21.55
  Bottom 0.305: IC1.20 54.57,15.84 60.04,21.31 61.37,21.31 62.23,22.16 64.76,22.16 v65.36,21.55
D3  (via drill 0.33 pad 0.64)
  Top 0.305: R7.1 64.83,28.34 65.21,28.34 v65.42,28.55 70.69,33.82 70.69,35.32 71.09,35.72 84.44,35.72 86.75,33.41 87.88,33.41 88.05,33.59 113.05,33.59 121.18,25.45 X2.5 X3.5
  Bottom 0.305: v65.42,28.55 65.42,26.65 60.76,22 60,22 53.77,15.77 IC1.21
D4  (via drill 0.33 pad 0.64)
  Top 0.305: R8.1 64.83,35.84 65.24,36.26 85.45,36.26 v87.61,34.09 116.01,34.09 121.89,28.22 X2.6 X3.6 | v80.18,20.85 75.94,16.61 v73.01,16.61
  Bottom 0.305: v80.18,20.85 87.61,28.28 v87.61,34.09 | IC1.25 50.21,15.15 49.67,14.6 49.67,7.78 51.37,6.08 51.37,3.38 52.35,2.4 67.13,2.4 73.01,8.28 v73.01,16.61
D5  (via drill 0.33 pad 0.64)
  Top 0.305: R9.1 64.83,41.13 68.51,37.46 87.33,37.46 90.02,34.77 118.83,34.77 122.61,30.99 X2.7 X3.7 | v48.19,4.33 48.38,4.33 48.88,4.83 50.53,4.83 50.78,5.09 50.78,5.57 v52.16,6.96
  Bottom 0.305: v48.19,4.33 51.65,0.87 67.9,0.87 76.26,9.22 82.12,9.22 87.55,3.79 113.11,3.79 125.03,15.71 125.03,20.42 125.91,21.3 126.55,21.3 127.39,22.13 127.39,29.81 X2.7 | IC1.22 52.97,7.76 v52.16,6.96
D6
  Top 0.305: R10.1 64.83,48.63 65.04,48.63 70.88,42.8 70.88,41.48 73.34,39.02 94.04,39.02 95.05,40.03 97.77,40.03 98.15,40.42 105.42,40.42 110.51,35.33 118.99,35.33 120.56,33.76 X2.8 X3.8
  Bottom 0.305: IC1.26 50.18,15.95 49.16,14.92 49.16,5.59 50.68,4.07 50.68,3.35 52.14,1.89 67.34,1.89 75.69,10.25 83.95,10.25 89.39,4.81 104.68,4.81 112.11,12.24 112.11,17.27 120.13,25.3 123.5,25.3 124.67,26.47 124.67,32.22 X2.8
D7  (via drill 0.33 pad 0.64)
  Top 0.305: v70.79,48.83 70.79,50.39 65.05,56.13 64.83,56.13 R11.1 64.83,57.79 64.83,58.34 62.3,60.88 43.77,60.88 40.88,57.99 40.88,56.62 37.2,52.95 26.49,52.95 24.59,51.05 24.59,25.93 28.74,21.78 v43.8,21.78 | X3.9 X2.9
  Bottom 0.305: X2.9 127.41,37.73 127.41,48.11 124.37,51.15 105.11,51.15 104.38,51.88 74.49,51.88 71.44,48.83 v70.79,48.83 | v43.8,21.78 48.83,16.75 IC1.27
D8  (via drill 0.33 pad 0.64)
  Top 0.305: v76.07,23.73 74.71,22.37 65.21,22.37 63.83,20.99 63.83,17.35 v64.41,16.77 63.83,16.18 63.83,11.34 63.97,11.2 v63.97,8.86 | X13.3 106.76,41.43 109.91,38.28 113.48,38.28 R19.1 114.49,39.39 114.58,39.29 X2.10 | v60.87,8.71 47.7,8.71 45.83,6.84 R21.2
  Bottom 0.305: IC1.8 63.75,15.95 64.41,16.61 v64.41,16.77 | X13.3 92.87,41.43 89.64,38.2 89.64,37.3 v76.07,23.73 | v60.87,8.71 63.82,8.71 v63.97,8.86
D9  (via drill 0.33 pad 0.64)
  Top 0.305: X13.4 100.33,42.7 v102.4,44.77 | v60.89,15.67 60.89,15 60.4,14.51 59.86,14.51 59.77,14.6 46.09,14.6 45.83,14.34 R41.2 | v60.89,15.67 | v68.41,16.69 69.4,17.68 73.47,17.68 v77.02,21.23 | R18.1 114.49,42.14 114.56,42.06 X2.11
  Bottom 0.305: v102.4,44.77 107.98,44.77 110.61,47.4 123.85,47.4 124.58,46.68 124.58,43.69 X2.11 | v60.89,15.67 61.4,15.15 IC1.9 66.87,15.15 v68.41,16.69 | 75.37,38.19 79.88,42.7 X13.4 | v77.02,21.23 75.37,22.88 75.37,38.19 | 75.37,38.19 72.9,38.19 71.03,36.32 ISP.3
D10  (via drill 0.33 pad 0.64)
  Top 0.305: 50.82,21.84 51.07,21.84 55.85,26.63 55.85,28.05 v60.9,33.09 | 50.82,21.84 45.83,21.84 R43.2 | 50.82,21.84 50.82,19.03 54.65,15.2 v60.13,15.2 | R17.1 114.49,45.14 114.79,44.83 X2.12
  Bottom 0.305: v60.13,15.2 60.97,14.35 IC1.10 | 69.88,33.09 69.88,37.69 76.15,43.97 94.64,43.97 | 69.88,33.09 v60.9,33.09 | 69.88,33.09 69.88,32.27 ISP.4 | X13.5 94.64,43.97 | 94.64,43.97 94.64,46.95 95.31,47.63 97.07,47.63 98.49,46.21 108.69,46.21 110.4,47.91 124.14,47.91 126.2,45.85 X2.12
D11  (via drill 0.33 pad 0.64)
  Top 0.305: X2.13 125.64,48.17 113.48,48.17 | X13.6 93.24,45.53 99.6,51.89 109.75,51.89 113.48,48.17 | v64.88,14.38 64.99,14.28 v101.54,14.28 | 113.48,48.17 112.63,47.32 v112.63,46.42 | R16.1 113.48,48.17 | v52.83,33.08 49.09,29.34 45.83,29.34 R45.2
  Bottom 0.305: v112.63,46.42 112.63,25.37 v101.54,14.28 | IC1.11 64.05,13.55 v64.88,14.38 | v52.83,33.08 52.98,32.93 59.42,32.93 60.72,34.24 68.49,34.24 ISP.1 68.49,38.15 69.62,38.15 76.7,45.24 X13.6
D12  (via drill 0.33 pad 0.64)
  Top 0.305: v44.4,25.23 44.25,25.38 44.25,35.16 44.83,35.74 R47.2 | X14.3 105.84,22.63 v112.78,15.69 | R15.1 114.49,20.84 115,20.32 v116.11,20.32
  Bottom 0.305: 43.32,22.97 43.12,22.77 43.12,10.91 50.17,3.86 50.17,3.14 51.93,1.38 67.55,1.38 75.9,9.74 82.36,9.74 87.81,4.3 104.91,4.3 113.66,13.04 113.66,14.8 | 43.32,22.97 43.27,23.02 43.27,24.1 v44.4,25.23 | 43.32,22.97 44.1,22.97 49.51,17.55 IC1.28 | 116.11,16.26 v116.11,20.32 | X2.14 116.61,15.76 116.11,16.26 | 113.66,14.8 114.65,14.8 116.11,16.26 | v112.78,15.69 113.66,14.8
D13  (via drill 0.33 pad 0.64)
  Top 0.305: 46.07,41.89 v48.45,41.89 | 46.07,41.89 40.88,36.7 40.88,26.4 43.61,23.67 v43.97,23.67 | 46.07,41.89 45.83,42.13 R49.2 | 117.53,20.79 | 117.53,20.79 118.04,20.79 118.07,20.83 v119.16,20.83 | 93.24,24.22 91.91,25.56 63.75,25.56 63.32,25.98 v63.32,39.26 | 117.53,20.79 114.49,23.84 R14.1 | 93.24,24.22 95.33,26.31 103.69,26.31 110.35,19.65 116.39,19.65 117.53,20.79 | 93.24,24.22 X14.4
  Bottom 0.305: v48.45,41.89 60.69,41.89 v63.32,39.26 | v43.97,23.67 44.26,23.67 49.58,18.35 IC1.29 | X2.15 121.06,20.83 v119.16,20.83
D14  (via drill 0.33 pad 0.64)
  Top 0.305: 95.78,24.52 94.04,22.78 78.42,22.78 76.77,24.43 64.15,24.43 62.81,25.77 62.81,36.3 v62.63,36.48 | v47.3,33.1 44.81,30.61 44.81,26.31 46.09,25.02 v46.09,24.26 | 120.19,20.88 120.61,21.3 X2.16 | 95.78,24.52 104.68,24.52 110.08,19.12 118.44,19.12 120.19,20.88 | 120.19,20.88 114.49,26.59 R13.1 | 95.78,24.52 X14.5 | v45.83,49.43 R51.2
  Bottom 0.305: 51.08,36.88 62.23,36.88 v62.63,36.48 | 51.08,36.88 v47.3,33.1 | v46.09,24.26 46.09,23.29 50.23,19.15 IC1.30 | 51.08,36.88 45.83,42.13 v45.83,49.43
D15  (via drill 0.33 pad 0.64)
  Top 0.305: X2.17 119.76,24.07 114.49,29.34 R12.1 113.48,30.44 110.85,33.07 99.58,33.07 93.24,26.73 X14.6 92.88,26.08 64.01,26.08 63.83,26.27 63.83,38.82 64.03,39.02 64.03,39.6 63.17,40.45 63.17,59.02 61.88,60.32 46.8,60.32 45.83,59.34 R53.2 | v83.06,20.86 77.74,15.54 v68.61,15.54
  Bottom 0.305: v83.06,20.86 88.64,26.44 X14.6 | IC1.12 61.72,12.18 65.25,12.18 v68.61,15.54
D+
  Bottom 0.305: R3.2 74.73,11.49 73.73,12.49 73.73,18.15 72.73,19.15 IC1.4
D-
  Bottom 0.305: R2.2 75.24,14.49 74.24,15.49 74.24,18.66 73.24,19.66 65.67,19.66 65.67,19.95 IC1.3
GND  (via drill 0.33 pad 0.64)
  Top 0.305: v66.18,18.45 v71.5,18.45 71.83,18.78 LEDD2.C 71.83,20.69 | 45.23,23.36 45.23,22.18 42.79,19.74 | 45.23,23.36 46.21,23.36 48.63,25.78 48.63,26.29 T4.2 50.74,26.29 51.21,25.82 v53.74,25.82 | 45.23,23.36 42.31,26.28 41.83,26.28 LEDS3.C 41.83,27.72 41.83,28.19 42.79,29.15 42.79,34.74 | 43.74,18.79 42.79,19.74 | 43.74,18.79 48.63,18.79 T3.2 | 43.74,18.79 43.74,13.19 42.79,12.24 | LEDS2.C 42.79,19.74 | LEDS1.C 42.79,12.24 | 43.68,11.29 42.79,12.18 42.79,12.24 | 43.68,11.29 48.63,11.29 T2.2 | 43.68,11.29 43.68,7.69 41.83,5.85 | 48.17,38.92 50.74,36.34 50.74,34.95 50.43,34.64 49.68,34.64 T5.2 | 42.79,34.74 46.96,38.92 48.17,38.92 | 48.17,38.92 49.68,40.43 T6.2 49.68,42.14 50.43,42.14 50.74,42.45 50.74,46.88 49.68,47.93 49.68,48.25 | 89,42.24 STATUS1.C 85.88,42.24 85.88,41.64 85.37,41.13 73.89,41.13 72.79,42.24 LEDD5.C | X13.2 91.16,42.24 89,42.24 | 89,48.52 89,42.24 | 89,48.52 87.79,49.74 STATUS2.C | 89,48.52 92.84,48.52 92.84,48.18 X13.8 | LEDD5.C 71.84,48.78 71.83,48.78 LEDD6.C LEDD7.C | LEDD5.C | LEDS5.C 41.83,43.19 44.27,45.63 44.27,48.25 | 44.27,48.25 42.79,49.74 LEDS6.C 41.83,54.12 43.87,56.16 | 49.68,48.25 44.27,48.25 | T7.2 49.68,48.25 | 30.61,5.85 29.5,4.74 S0.3 | 41.83,5.85 30.61,5.85 | S1.3 28.32,8.14 30.61,5.85 | 41.83,5.85 41.83,5.69 LEDS0.C 42.79,4.74 43.87,3.66 48.5,3.66 48.63,3.79 T1.2 50.74,3.79 51.44,3.09 v64.23,3.09 69.82,3.09 70.88,4.14 70.88,4.74 71.13,4.74 | X14.2 92.69,21.91 76.4,21.91 75.19,20.69 71.83,20.69 | 71.83,20.69 71.37,20.69 v71.2,20.86 | 16.42,38.84 v16.42,38.37 | 16.42,38.84 21.39,38.84 v22.4,37.84 | 16.42,38.84 9.97,38.84 S11.4 9.97,35.63 10.26,35.34 10.26,26.64 9.97,26.34 S11.3
  Top 0.305: X14.8 91.45,27.19 v73,27.19 72.95,27.24 72.72,27.24 LEDD3.C LEDD4.C | S3.3 S4.3 | LEDS4.C 42.79,34.74 | 43.87,56.16 48.5,56.16 48.63,56.29 T8.2 | 43.87,56.16 42.79,57.24 LEDS7.C | LEDD1.C 71.83,11.28 72.82,10.29 72.82,9.83 | 72.82,9.83 71.13,8.14 71.13,4.74 | X12.MP1 89.79,9.83 72.82,9.83 | LEDD0.C 71.13,4.74 | X3.24 X2.24 | X12.MP2 100.6,7.34 X12.GND
  Bottom 0.305: IC1.5 66.07,18.35 v66.18,18.45 | v71.5,18.45 71.03,17.99 70.99,17.99 C5.2 69.98,16.88 69.98,6.03 66.98,3.03 64.29,3.03 v64.23,3.09 64.04,3.09 | X12.MP2 104.32,10.21 120.95,26.84 X2.18 X2.19 X2.20 X2.21 X2.22 X2.23 X2.24 X2.25 | X14.2 94.35,22.46 94.35,27.87 X14.8 X13.2 | 57.48,29.94 56.93,29.39 56.93,27.19 58.57,25.54 IC1.41 | 57.48,29.94 56.93,29.94 56.02,30.85 55.34,30.85 53.74,29.24 v53.74,25.82 53.77,25.78 IC1.35 | 57.48,29.94 C6.2 59.93,29.94 | S1.3 S2.3 S3.3 | S7.3 S6.3 S5.3 28.32,37.84 | v71.2,20.86 71.04,20.86 71,20.82 C3.1 | 12.34,39.27 13.24,38.37 v16.42,38.37 16.6,38.54 17.42,38.54 IC2.9 | 28.32,37.84 v22.4,37.84 | S4.3 28.32,37.84 | IC1.15 58.57,9.19 61.83,5.94 C8.2 64.04,5.94 64.04,3.09 | 64.04,3.09 63.98,3.03 52.43,3.03 52.22,3.24 52.22,5.76 52.41,5.94 | C1.- 70.21,25.24 71.05,25.24 v73,27.19 73,30.54 ISP.6 | X12.MP1 92.5,7.56 98.37,7.56 X12.GND | 64.04,3.09 | 52.41,5.94 52.23,5.94 50.85,7.31 IC1.23 | C7.2 52.41,5.94 | C2.2 59.93,29.94 | IC1.43 60.17,24.29 59.93,24.53 59.93,29.94 | IC2.5 12.34,39.27 | 12.34,39.27 11.07,39.27 | 11.07,39.27 10.34,38.54 9.8,38.54 IC2.3 9.8,41.45 6.8,41.45 5.39,40.04 5.39,38.04 C4.1 | IC2.4 11.07,39.27 | X3.18 X3.19 X3.20 X3.21 X3.22 X3.23 X3.24
  pour Bottom: 0.03,53.49 0.03,61.99 157.53,61.99 157.53,-0.01 0.03,-0.01
  pour Top: 0.03,53.49 0.03,61.99 157.53,61.99 157.53,-0.01 0.03,-0.01
N$1
  Bottom 0.305: R2.1 83.99,14.49 88.94,9.53 X12.D-
N$2
  Bottom 0.305: R3.1 83.99,11.49 90.15,5.32 96.1,5.32 X12.D+
N$3
  Top 0.305: R20.1 LEDD8.A
N$4
  Top 0.305: T1.3 LEDD8.C
N$5
  Top 0.305: T1.1 48.63,5.69 48.58,5.74 R21.1
N$6
  Bottom 0.305: 61.03,23.78 61.03,23.03 60.51,22.51 59.75,22.51 51.58,14.35 IC1.24 | 61.03,23.78 61.03,23.73 IC1.44 | 61.03,23.78 C2.1 L2.1
N$7
  Top 0.305: R1.2 LEDD0.A
N$8
  Top 0.305: R4.2 LEDD1.A
N$13  (via drill 0.33 pad 0.64)
  Top 0.305: R26.1 v77.32,49.74 | v54.56,33.61 54.53,33.58 v54.53,29.02
  Bottom 0.305: v77.32,49.74 63.23,35.65 56.59,35.65 v54.56,33.61 | IC1.38 56.17,25.25 54.53,26.89 v54.53,29.02
N$14  (via drill 0.33 pad 0.64)
  Top 0.305: R28.1 73.77,42.24 v73.23,42.77 | v58.59,33.64 58.59,32.16 55.66,29.23 v55.37,29.23
  Bottom 0.305: v73.23,42.77 71.48,42.77 63.76,35.05 60.01,35.05 | 60.01,35.05 | 60.01,35.05 v58.59,33.64 | v55.37,29.23 55.37,27.22 56.97,25.62 IC1.39
N$15
  Top 0.305: STATUS2.A R26.2
N$16
  Top 0.305: STATUS1.A R28.2
N$20
  Top 0.305: R6.2 LEDD2.A
N$26
  Top 0.305: R7.2 LEDD3.A
N$27
  Top 0.305: R8.2 LEDD4.A
N$28
  Top 0.305: R9.2 LEDD5.A
N$29
  Top 0.305: R10.2 LEDD6.A
N$30
  Top 0.305: R11.2 LEDD7.A
N$31
  Top 0.305: R32.2 LEDS0.A
N$32
  Top 0.305: R33.2 LEDS1.A
N$33
  Top 0.305: R34.2 LEDS2.A
N$34
  Top 0.305: R35.2 LEDS3.A
N$35
  Top 0.305: R36.2 LEDS4.A
N$36
  Top 0.305: R37.2 LEDS5.A
N$37
  Top 0.305: R38.2 LEDS6.A
N$38
  Top 0.305: R39.2 LEDS7.A
N$39  (via drill 0.33 pad 0.64)
  Top 0.305: 17.59,32.55 S11.1 | S11.2 17.59,32.55 | 17.59,32.55 v21.43,32.55
  Bottom 0.305: IC1.36 54.57,23 54.04,22.47 52.49,22.47 43.74,31.21 22.77,31.21 v21.43,32.55
N$40
  Top 0.305: R40.1 LEDD9.A
N$41
  Top 0.305: T2.3 LEDD9.C
N$42
  Top 0.305: T2.1 48.63,13.19 48.58,13.24 R41.1
N$43
  Top 0.305: R42.1 LEDD10.A
N$45
  Top 0.305: T3.3 LEDD10.C
N$47
  Top 0.305: R43.1 48.74,20.74 48.79,20.69 T3.1
N$48
  Bottom 0.305: C6.1 58.03,27.03 59.37,25.69 IC1.42
N$50
  Bottom 0.305: C5.1 67.08,17.99 66.64,17.55 IC1.6
N$52
  Top 0.305: R44.1 LEDD11.A
N$53
  Top 0.305: T4.3 LEDD11.C
N$54
  Top 0.305: T4.1 48.63,28.19 48.58,28.24 R45.1
N$55
  Top 0.305: R46.1 LEDD12.A
N$56
  Top 0.305: T5.3 LEDD12.C
N$57
  Top 0.305: T5.1 48.63,35.69 48.58,35.74 R47.1
N$58
  Top 0.305: R48.1 LEDD13.A
N$59
  Top 0.305: T6.3 LEDD13.C
N$60
  Top 0.305: R49.1 48.74,43.24 48.79,43.19 T6.1
N$61
  Top 0.305: R50.1 LEDD14.A
N$62
  Top 0.305: T7.3 LEDD14.C
N$63
  Top 0.305: R51.1 48.74,50.74 48.79,50.69 T7.1
N$64
  Top 0.305: R52.1 LEDD15.A
N$65
  Top 0.305: T8.3 LEDD15.C
N$66
  Top 0.305: R53.1 48.74,58.24 48.79,58.19 T8.1
RESET  (via drill 0.33 pad 0.64)
  Top 0.305: v63.28,10.91 63.28,21.21 65.67,23.6 v71.54,23.6
  Bottom 0.305: ISP.5 74.72,35.05 74.72,26.78 v71.54,23.6 | 63.28,10.27 v63.28,10.91 | 63.28,10.27 64.97,10.27 66.03,9.21 66.03,6.94 R5.1 | IC1.13 60.17,10.8 60.7,10.27 63.28,10.27
S0
  Top 0.305: R32.1 33.83,4.74 31.81,2.73 27.79,2.73 26.96,3.56 26.96,4.74 S0.2
  Bottom 0.305: S0.2 26.96,4.74 26.96,13.62 23.29,17.3 23.14,17.3 17.48,22.96 IC2.10
S1
  Top 0.305: R33.1 33.83,12.24 31.81,14.25 27.8,14.25 26.96,13.42 26.96,12.24 S1.2
  Bottom 0.305: S1.2 24.6,12.24 24.6,13.42 16.21,21.81 IC2.11
S2
  Top 0.305: S2.2 26.96,19.74 26.96,18.56 27.79,17.73 31.82,17.73 33.83,19.74 R34.1
  Bottom 0.305: IC2.12 14.94,32.25 17.97,32.25 19.27,30.96 19.27,26.25 24.6,20.92 24.6,19.74 S2.2
S3
  Top 0.305: R35.1 33.83,27.24 31.81,25.22 27.8,25.22 26.96,26.06 26.96,27.24 S3.2
  Bottom 0.305: IC2.13 13.67,32.25 14.17,32.76 20.26,32.76 24.6,28.42 24.6,27.24 S3.2
S4
  Top 0.305: R36.1 33.83,34.74 31.82,36.75 27.79,36.75 26.96,35.92 26.96,34.74 S4.2
  Bottom 0.305: IC2.14 12.4,32.25 14.74,34.6 19.8,34.6 21.95,36.75 23.77,36.75 24.6,35.92 24.6,34.74 S4.2
S5
  Top 0.305: R37.1 33.83,42.24 31.82,44.25 27.79,44.25 26.96,43.42 26.96,42.24 S5.2
  Bottom 0.305: IC2.15 11.13,32.25 14.18,35.31 18.85,35.31 24.6,41.06 24.6,42.24 S5.2
S6
  Top 0.305: R38.1 33.83,49.74 31.82,51.75 27.79,51.75 26.96,50.92 26.96,49.74 S6.2
  Bottom 0.305: IC2.16 9.86,32.25 13.67,36.07 16.42,36.07 20.74,40.38 20.74,42.69 25.78,47.73 S6.2
S7
  Top 0.305: R39.1 33.83,57.24 31.81,59.25 27.8,59.25 26.96,58.42 26.96,57.24 S7.2
  Bottom 0.305: IC2.17 8.56,32.25 13.68,37.38 17,37.38 18.54,38.92 18.54,42.54 24.6,48.6 24.6,57.24 S7.2
SCL  (via drill 0.33 pad 0.64)
  Top 0.305: v7.24,38.11 5.58,36.45 5.58,29.99 v5.6,29.97
  Bottom 0.305: IC1.31 51.48,19.95 52.04,20.51 52.04,21.8 47.44,26.41 43.86,26.41 29.5,12.05 29.5,3.34 28.87,2.71 25.27,2.71 24.51,3.47 24.51,8.4 20.47,12.44 20.47,15.79 6.92,29.34 6.23,29.34 v5.6,29.97 3.43,27.8 R30.1 | IC2.1 7.26,38.12 v7.24,38.11
SDA  (via drill 0.33 pad 0.64)
  Top 0.305: v6.76,28.53 6.76,32.01 v6.26,32.51
  Bottom 0.305: IC1.32 50.23,20.75 46.77,24.21 46.77,24.54 45.41,25.9 44.11,25.9 30.13,11.92 30.13,3.25 29.08,2.2 23.24,2.2 21.78,3.66 21.78,3.74 21.78,9.24 19.53,11.49 19.53,14.49 7.78,26.24 7.03,26.24 | v6.76,28.53 6.76,28.02 5.98,27.24 5.98,26.74 R31.1 7.03,26.24 | 7.03,26.24 7.09,26.24 | v6.26,32.51 8.53,34.78 IC2.2
XTAL1
  Bottom 0.406: C7.1 56.03,4.04 X1.P$1 56.97,4.99 IC1.17
XTAL2
  Bottom 0.406: C8.1 60.03,4.04 X1.P$2 59.53,4.99 59.53,6.49 58.53,7.49 57.77,7.49 IC1.16

### Text on the board
tPlace: Biosemi | Biopac | Button / Link A | Button / Link B
bNames: Box2020 V1B3 / Universiteit Leiden SOLO / Evert 2020
Measures: 7x | Gaten: / Led - 3mm rond maat, Checked / Switch - 5mm rond maat, Checked / Microfoon - 6x8mm, hoek straal 1R nog ruimer Checked / Button - 6.5m, veriferen / Usb - 12x10.6mm nog ruimer, checked / Rj45- 15.4x16.2 nog ruimer, checked / / Note: alle maten volgens datasheet, denk om overmaat (nog ruimer hierboven genoemd) / Checked=Maten zijn gecontroleerd aan de hand van datasheet en fysiek / / Check of d25 niet te dicht bij elkaar